# Altium schematic sheet Schematic.SchDoc
size A4; SheetNumber: 1; SheetTotal: 1
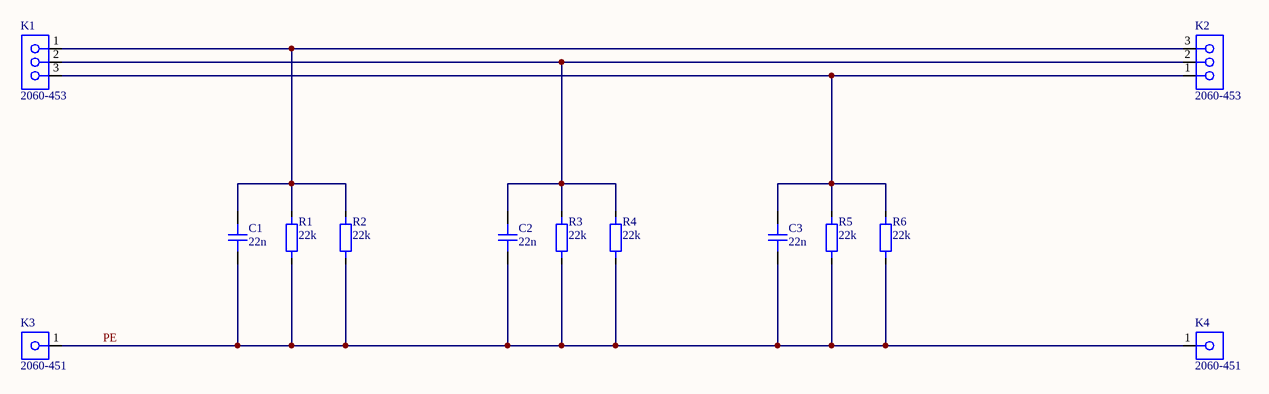
[diagram p0: Schematic.SchDoc]

## Parts
C1  22n  [C-FOIL-18x13x7]
C2  22n  [C-FOIL-18x13x7]
C3  22n  [C-FOIL-18x13x7]
K1  2060-453  [2060-453]
K2  2060-453  [2060-453]
K3  2060-451  [2060-451]
K4  2060-451  [2060-451]
R1  22k  [R1206]
R2  22k  [R1206]
R3  22k  [R1206]
R4  22k  [R1206]
R5  22k  [R1206]
R6  22k  [R1206]

## Nets
PE: C1.2 C2.2 C3.2 K3.1 K4.1 R1.1 R2.1 R3.1 R4.1 R5.1 R6.1
NetC1_1: C1.1 K1.1 K2.3 R1.2 R2.2
NetC2_1: C2.1 K1.2 K2.2 R3.2 R4.2
NetC3_1: C3.1 K1.3 K2.1 R5.2 R6.2

## Library data of the parts
C1-C3 = C_22n_18x13x7_10%_300V_MKP: 22n THT 10% Y2 MKP 300VAC; Part Number: C_22n_18x13x7_10%_300V_MKP
K1 K2 = 2060-453/998-404: 2060-453 3P Wago Spring Clamp Terminal SMD; Part Number: 2060-453/998-404; JLCPCB Part: C2765056
K3 K4 = 2060-451/998-404: 2060-451 1P Wago Spring Clamp Terminal SMD; Part Number: 2060-451/998-404; JLCPCB Part: C2765054
R1-R6 = R_22k_1206_1%_200V_250mW: 22k SMD 1206 1% 200V 250mW; Part Number: R_22k_1206_1%_200V_250mW